# Altium schematic sheet MCU48pin.SchDoc
size 381 x 241 mm
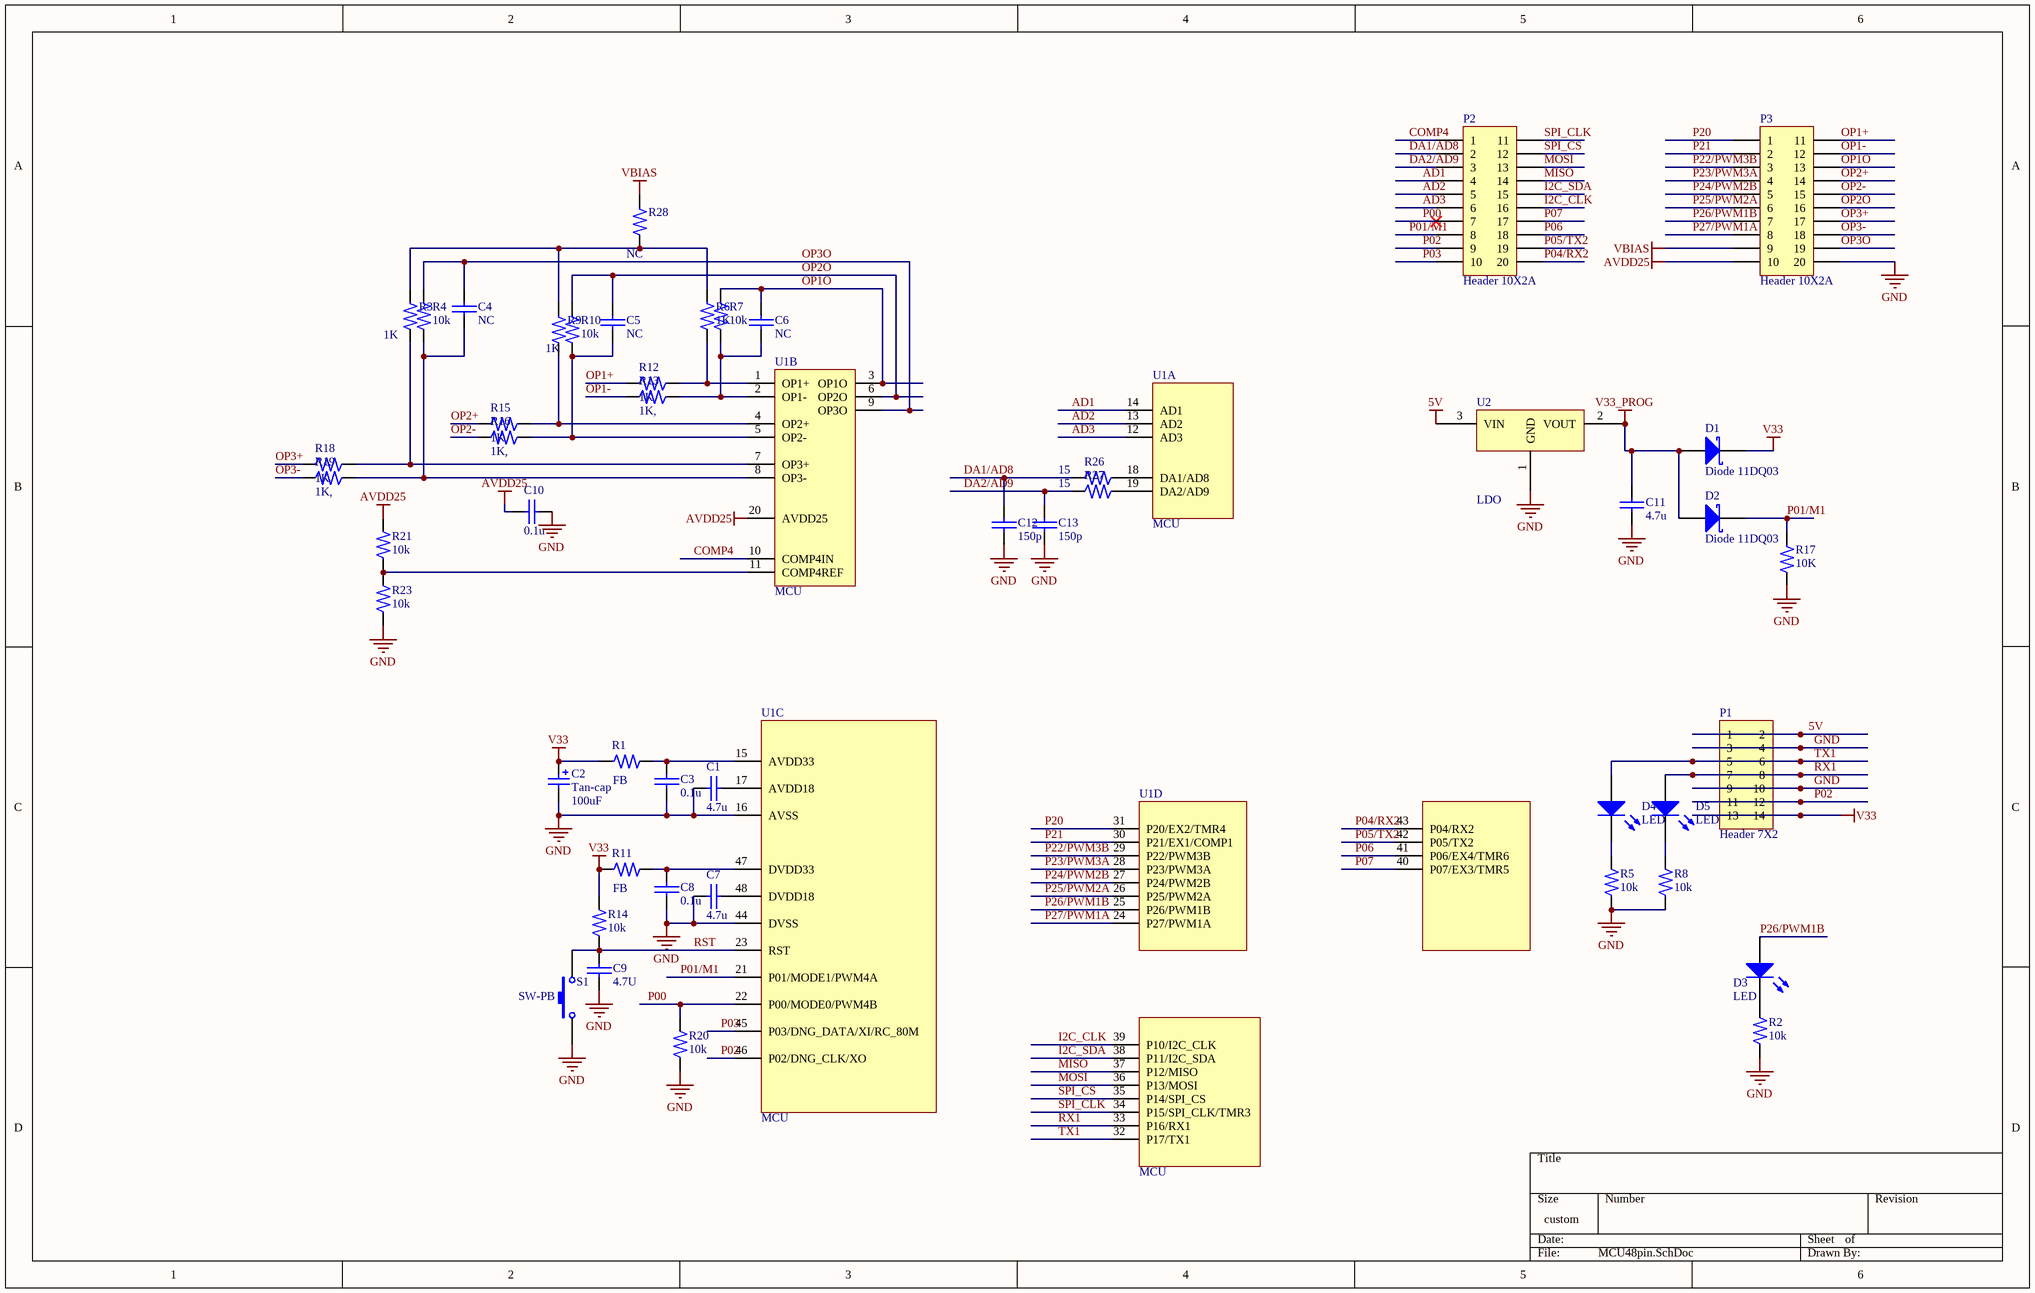
[diagram p0: MCU48pin.SchDoc]

## Parts
C1  4.7u  [C0805]
C2  Tan-cap  value 100uF  [R1206w]
C3  0.1u  [1608[0603]]
C4  NC  [1608[0603]]
C5  NC  [1608[0603]]
C6  NC  [1608[0603]]
C7  4.7u  [C0805]
C8  0.1u  [1608[0603]]
C9  4.7U  [1608[0603]]
C10  0.1u  [1608[0603]]
C11  4.7u  [C0805]
C12  150p  [1608[0603]]
C13  150p  [1608[0603]]
D1  Diode 11DQ03  [D0603]
D2  Diode 11DQ03  [D0603]
D3  LED  [D0603]
D4  LED  [D0603]
D5  LED  [D0603]
P1  Header 7X2  [HDR2X7]
P2  Header 10X2A  [HDR2X10_CEN]
P3  Header 10X2A  [HDR2X10_CEN]
R1  FB  [R0603]
R2  10k  [R0603]
R3  1K  [R0603]
R4  10k  [R0603]
R5  10k  [R0603]
R6  1K  [R0603]
R7  10k  [R0603]
R8  10k  [R0603]
R9  1K  [R0603]
R10  10k  [R0603]
R11  FB  [R0603]
R12  1K  [R0603]
R13  1K,  [R0603]
R14  10k  [R0603]
R15  1K  [R0603]
R16  1K,  [R0603]
R17  10K  [R0603]
R18  1K  [R0603]
R19  1K,  [R0603]
R20  10k  [R0603]
R21  10k  [R0603]
R23  10k  [R0603]
R26  15  [R0603]
R27  15  [R0603]
R28  NC  [R0603]
S1  SW-PB  [SW]
U1  MCU  [TSSOP48]  (parts A,B,C,D of 4)
U2  LDO  [SOT223_M]

## Nets
5V: P1.1 P1.2 U2.3(VIN)
AVDD25: C10.1 P3.10 R21.2 U1.20(AVDD25)
GND: C1.1 C2.2 C3.2 C7.1 C8.2 C9.2 C10.2 C11.1 C12.2 C13.2 P1.3 P1.4 P1.9 P1.10 P3.20 R2.1 R5.1 R8.1 R17.2 R20.1 R23.1 S1.1 U1.16(AVSS) U1.44(DVSS) U2.1(GND)
V33: C2.1 D1.2(K) P1.13 P1.14 R1.1 R11.1 R14.2
V33_PROG: C11.2 D1.1(A) D2.1(A) U2.2(VOUT)
VBIAS: P3.9 R28.1
AD1: P2.4 U1.14(AD1)
AD2: P2.5 U1.13(AD2)
AD3: P2.6 U1.12(AD3)
COMP4: P2.1 U1.10(COMP4IN)
DA1/AD8: C12.1 P2.2 R26.2
DA2/AD9: C13.1 P2.3 R27.2
I2C_CLK: P2.16 U1.39(P10/I2C_CLK)
I2C_SDA: P2.15 U1.38(P11/I2C_SDA)
MISO: P2.14 U1.37(P12/MISO)
MOSI: P2.13 U1.36(P13/MOSI)
OP1+: P3.11 R12.2
OP1-: P3.12 R13.2
OP1O: C6.1 P3.13 R7.1 U1.3(OP1O)
OP2+: P3.14 R15.2
OP2-: P3.15 R16.2
OP2O: C5.1 P3.16 R10.1 U1.6(OP2O)
OP3+: P3.17 R18.2
OP3-: P3.18 R19.2
OP3O: C4.1 P3.19 R4.1 U1.9(OP3O)
P00: P2.7 R20.2 U1.22(P00/MODE0/PWM4B)
P01/M1: D2.2(K) P2.8 R17.1 U1.21(P01/MODE1/PWM4A)
P02: P1.11 P1.12 P2.9 U1.46(P02/DNG_CLK/XO)
P03: P2.10 U1.45(P03/DNG_DATA/XI/RC_80M)
P04/RX2: P2.20 U1.43(P04/RX2)
P05/TX2: P2.19 U1.42(P05/TX2)
P06: P2.18 U1.41(P06/EX4/TMR6)
P07: P2.17 U1.40(P07/EX3/TMR5)
P20: P3.1 U1.31(P20/EX2/TMR4)
P21: P3.2 U1.30(P21/EX1/COMP1)
P22/PWM3B: P3.3 U1.29(P22/PWM3B)
P23/PWM3A: P3.4 U1.28(P23/PWM3A)
P24/PWM2B: P3.5 U1.27(P24/PWM2B)
P25/PWM2A: P3.6 U1.26(P25/PWM2A)
P26/PWM1B: D3.1(A) P3.7 U1.25(P26/PWM1B)
P27/PWM1A: P3.8 U1.24(P27/PWM1A)
RST: C9.1 R14.1 S1.2 U1.23(RST)
RX1: D5.1(A) P1.7 P1.8 U1.33(P16/RX1)
SPI_CLK: P2.11 U1.34(P15/SPI_CLK/TMR3)
SPI_CS: P2.12 U1.35(P14/SPI_CS)
TX1: D4.1(A) P1.5 P1.6 U1.32(P17/TX1)
NetC1_2: C1.2 U1.17(AVDD18)
NetC3_1: C3.1 R1.2 U1.15(AVDD33)
NetC4_2: C4.2 R4.2 R19.1 U1.8(OP3-)
NetC5_2: C5.2 R10.2 R16.1 U1.5(OP2-)
NetC6_2: C6.2 R7.2 R13.1 U1.2(OP1-)
NetC7_2: C7.2 U1.48(DVDD18)
NetC8_1: C8.1 R11.2 U1.47(DVDD33)
NetD3_2: D3.2(K) R2.2
NetD4_2: D4.2(K) R5.2
NetD5_2: D5.2(K) R8.2
NetR3_1: R3.1 R6.1 R9.1 R28.2
NetR3_2: R3.2 R18.1 U1.7(OP3+)
NetR6_2: R6.2 R12.1 U1.1(OP1+)
NetR9_2: R9.2 R15.1 U1.4(OP2+)
NetR21_1: R21.1 R23.2 U1.11(COMP4REF)
NetR26_1: R26.1 U1.18(DA1/AD8)
NetR27_1: R27.1 U1.19(DA2/AD9)

## Library data of the parts
C1 C3-C13 = CAP NP: CAP NL; manufacturer: Yageo; part number: CC0603KRX7R9BB103; remark: C-CAP 10N 50V X7R  0603 K
C2 = Cap Pol1: Polarized Capacitor (Radial); Published: 8-Jun-2000; LatestRevisionDate: 17-Jul-2002; LatestRevisionNote: Re-released for DXP Platform.; PackageReference: RB7.6-15; Publisher: Altium Limited
D1 D2 = Diode 11DQ03: Schottky Rectifier; Published: 8-Jun-2000; LatestRevisionDate: 17-Jul-2002; LatestRevisionNote: Re-released for DXP Platform.; DatasheetVersion: Dec-1997; PackageReference: DO-204AL; Publisher: Altium Limited; PackageDescription: Diode, Axial; Body 5.2 x 2.7 mm (LxDia. max), Lead Dia. 0.86 mm (max); Code_JEDEC: DO-204-AL; ComponentLink1Description: Manufacturer Link; ComponentLink1URL: http://www.irf.com/; ComponentLink2Description: Datasheet; ComponentLink2URL: http://www.irf.com/product-info/datasheets/data/11dq03.pdf
D3-D5 = LED2: Typical RED, GREEN, YELLOW, AMBER GaAs LED; Published: 8-Jun-2000; LatestRevisionDate: 17-Jul-2002; LatestRevisionNote: Re-released for DXP Platform.; PackageVersion: Feb-2002; PackageReference: 3.2X1.6X1.1; Publisher: Altium Limited; PackageDescription: SM LED; 2 Flat Leads
P1 = Header 7X2: Header, 7-Pin, Dual row; LatestRevisionDate: 17-Jul-2002; LatestRevisionNote: Re-released for DXP Platform.; Publisher: Altium Limited
P2 P3 = Header 10X2A: Header, 10-Pin, Dual row; LatestRevisionDate: 17-Jul-2002; LatestRevisionNote: Re-released for DXP Platform.; Publisher: Altium Limited
R1-R21 R23 R26-R28 = RES: manufacturer: Yageo; part number: RC0603JR-071KL; remark: RES-TF 1K  0.1W 0603 5%
S1 = SW-PB: Switch; Published: 24-Mar-1999; LatestRevisionDate: 17-Jul-2002; LatestRevisionNote: Re-released for DXP Platform.; PackageReference: SPST-2; Publisher: Altium Limited